# EAGLE design FT2232H-breakout-v1a (EAGLE 5.11)
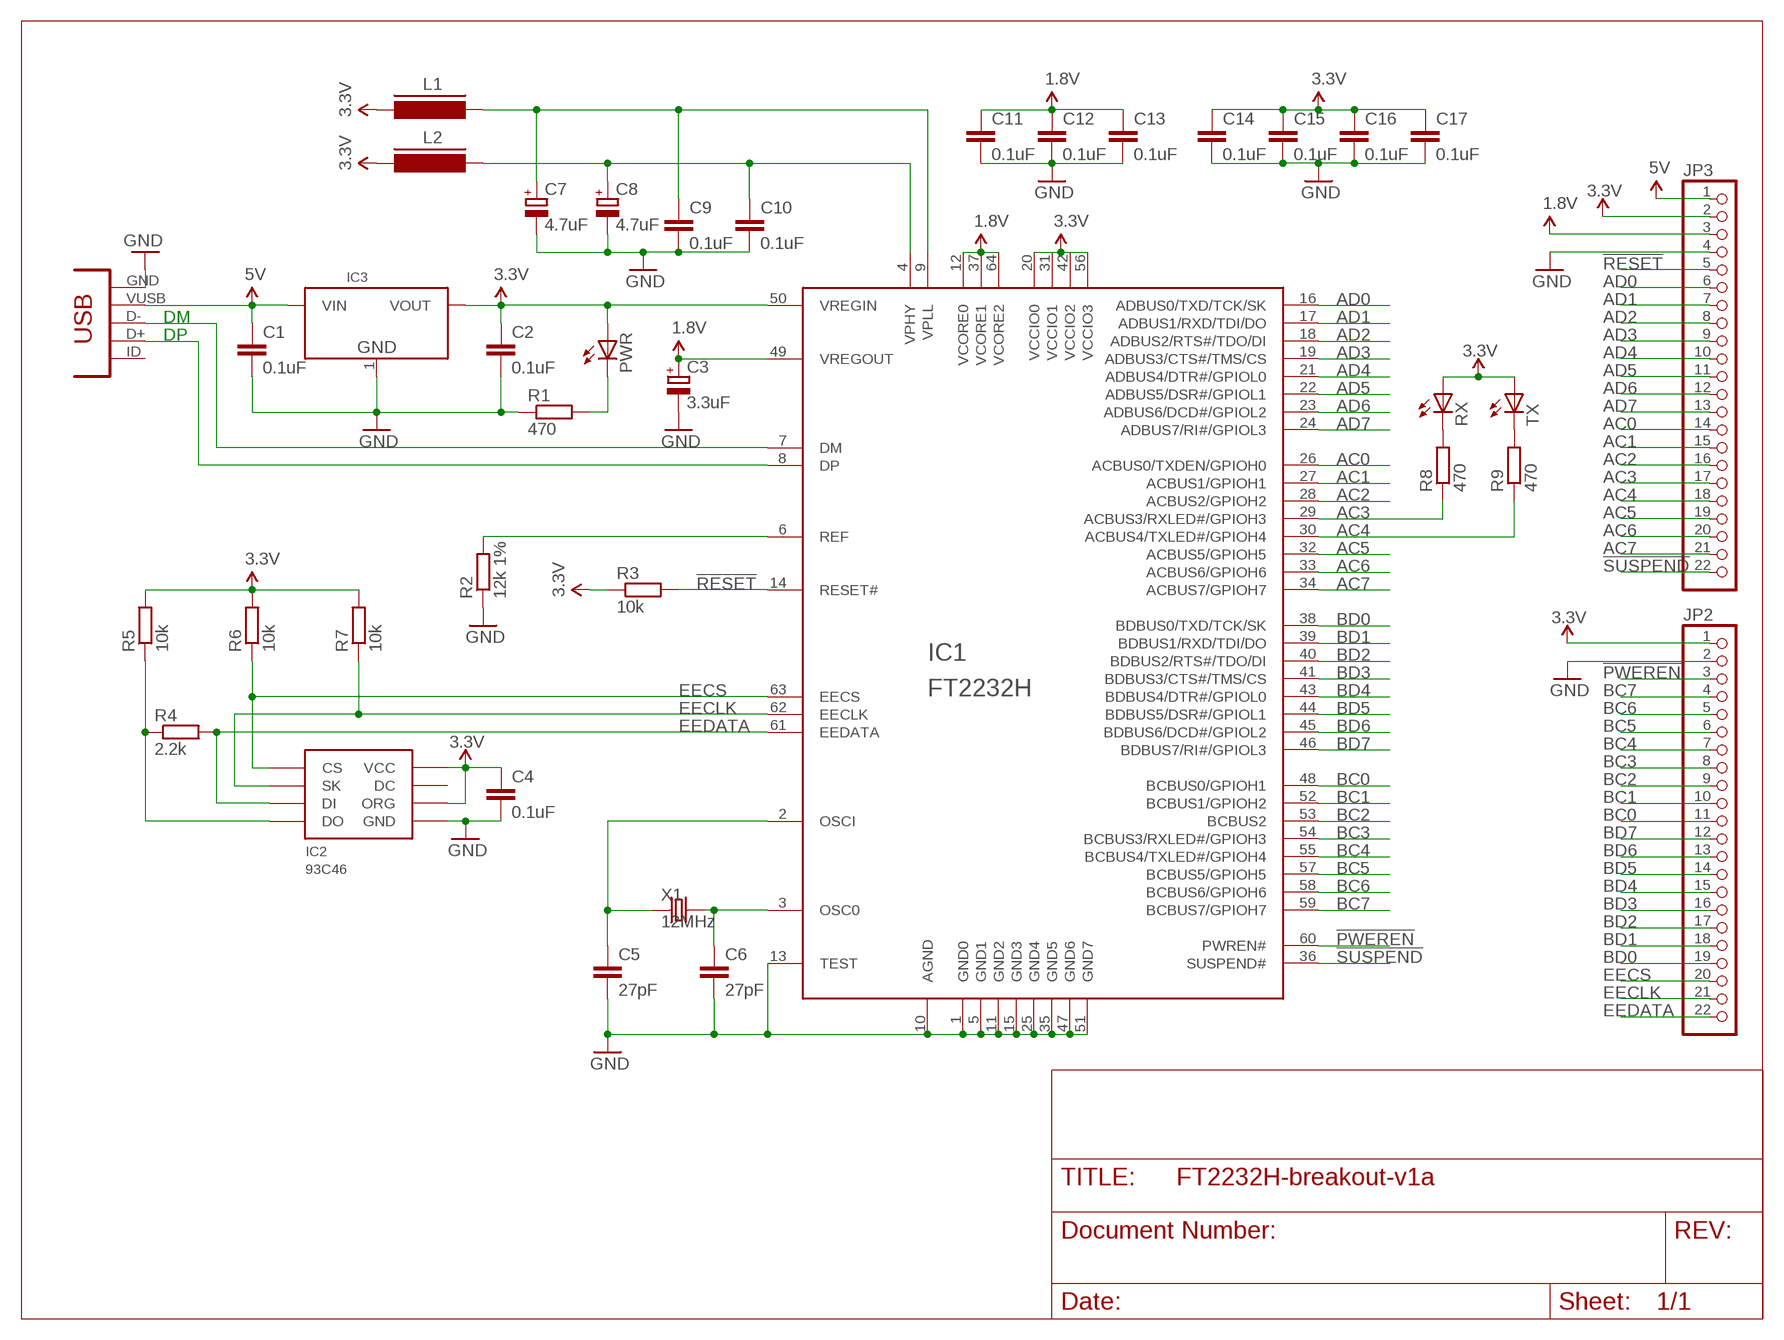
[diagram p0: schematic, sheet 1]

## Parts
C1  0.1uF  CAPC805  [C805]
C2  0.1uF  CAPC805  [C805]
C3  3.3uF  CAP_POLSMC_A  [SMC_A]
C4  0.1uF  CAPC805  [C805]
C5  27pF  CAPC805  [C805]
C6  27pF  CAPC805  [C805]
C7  4.7uF  CAP_POLSMC_A  [SMC_A]
C8  4.7uF  CAP_POLSMC_A  [SMC_A]
C9  0.1uF  CAPC805  [C805]
C10  0.1uF  CAPC805  [C805]
C11  0.1uF  CAPC805  [C805]
C12  0.1uF  CAPC805  [C805]
C13  0.1uF  CAPC805  [C805]
C14  0.1uF  CAPC805  [C805]
C15  0.1uF  CAPC805  [C805]
C16  0.1uF  CAPC805  [C805]
C17  0.1uF  CAPC805  [C805]
CONN1  CONN_USB  [CONN_USB_MINI-B]
IC1  FT2232H  [LQFP64]
IC2  93C46  [SOIC8]
IC3  LD1117-3.3SOT223  [SOT223]
JP2  PINHD-1X22  [1X22]
JP3  PINHD-1X22  [1X22]
L1  FERRITE_BEAD805  [FB805]
L2  FERRITE_BEAD805  [FB805]
PWR  LED805  [LED-805]
R1  470  RESISTORR805R805  [R805]
R2  12k 1%  RESISTORR805R805  [R805]
R3  10k  RESISTORR805R805  [R805]
R4  2.2k  RESISTORR805R805  [R805]
R5  10k  RESISTORR805R805  [R805]
R6  10k  RESISTORR805R805  [R805]
R7  10k  RESISTORR805R805  [R805]
R8  470  RESISTORR805R805  [R805]
R9  470  RESISTORR805R805  [R805]
RX  LED805  [LED-805]
TX  LED805  [LED-805]
X1  12MHz  CRYSTAL_212M_  [4X6]

## Nets
1.8V: C3.+ C11.1 C12.1 C13.1 IC1.12(VCORE0) IC1.37(VCORE1) IC1.49(VREGOUT) IC1.64(VCORE2) JP3.3
3.3V: C2.1 C4.1 C14.1 C15.1 C16.1 C17.1 IC1.20(VCCIO0) IC1.31(VCCIO1) IC1.42(VCCIO2) IC1.50(VREGIN) IC1.56(VCCIO3) IC2.6(ORG) IC2.8(VCC) IC3.2(VOUT) JP2.1 JP3.2 L1.2 L2.2 PWR.A R3.1 R5.2 R6.2 R7.2 RX.A TX.A
5V: C1.1 CONN1.VUSB IC3.3(VIN) JP3.1
!PWEREN: IC1.60(PWREN#) JP2.3
!RESET: IC1.14(RESET#) JP3.5 R3.2
!SUSPEND: IC1.36(SUSPEND#) JP3.22
AC0: IC1.26(ACBUS0/TXDEN/GPIOH0) JP3.14
AC1: IC1.27(ACBUS1/GPIOH1) JP3.15
AC2: IC1.28(ACBUS2/GPIOH2) JP3.16
AC3: IC1.29(ACBUS3/RXLED#/GPIOH3) JP3.17 R8.1
AC4: IC1.30(ACBUS4/TXLED#/GPIOH4) JP3.18 R9.1
AC5: IC1.32(ACBUS5/GPIOH5) JP3.19
AC6: IC1.33(ACBUS6/GPIOH6) JP3.20
AC7: IC1.34(ACBUS7/GPIOH7) JP3.21
AD0: IC1.16(ADBUS0/TXD/TCK/SK) JP3.6
AD1: IC1.17(ADBUS1/RXD/TDI/DO) JP3.7
AD2: IC1.18(ADBUS2/RTS#/TDO/DI) JP3.8
AD3: IC1.19(ADBUS3/CTS#/TMS/CS) JP3.9
AD4: IC1.21(ADBUS4/DTR#/GPIOL0) JP3.10
AD5: IC1.22(ADBUS5/DSR#/GPIOL1) JP3.11
AD6: IC1.23(ADBUS6/DCD#/GPIOL2) JP3.12
AD7: IC1.24(ADBUS7/RI#/GPIOL3) JP3.13
BC0: IC1.48(BCBUS0/GPIOH1) JP2.11
BC1: IC1.52(BCBUS1/GPIOH2) JP2.10
BC2: IC1.53(BCBUS2) JP2.9
BC3: IC1.54(BCBUS3/RXLED#/GPIOH3) JP2.8
BC4: IC1.55(BCBUS4/TXLED#/GPIOH4) JP2.7
BC5: IC1.57(BCBUS5/GPIOH5) JP2.6
BC6: IC1.58(BCBUS6/GPIOH6) JP2.5
BC7: IC1.59(BCBUS7/GPIOH7) JP2.4
BD0: IC1.38(BDBUS0/TXD/TCK/SK) JP2.19
BD1: IC1.39(BDBUS1/RXD/TDI/DO) JP2.18
BD2: IC1.40(BDBUS2/RTS#/TDO/DI) JP2.17
BD3: IC1.41(BDBUS3/CTS#/TMS/CS) JP2.16
BD4: IC1.43(BDBUS4/DTR#/GPIOL0) JP2.15
BD5: IC1.44(BDBUS5/DSR#/GPIOL1) JP2.14
BD6: IC1.45(BDBUS6/DCD#/GPIOL2) JP2.13
BD7: IC1.46(BDBUS7/RI#/GPIOL3) JP2.12
DM: CONN1.D- IC1.7(DM)
DP: CONN1.D+ IC1.8(DP)
EECLK: IC1.62(EECLK) IC2.2(SK) JP2.21 R7.1
EECS: IC1.63(EECS) IC2.1(CS) JP2.20 R6.1
EEDATA: IC1.61(EEDATA) IC2.3(DI) JP2.22 R4.2
GND: C1.2 C2.2 C3.- C4.2 C5.2 C6.2 C7.- C8.- C9.2 C10.2 C11.2 C12.2 C13.2 C14.2 C15.2 C16.2 C17.2 CONN1.GND IC1.1(GND0) IC1.5(GND1) IC1.10(AGND) IC1.11(GND2) IC1.13(TEST) IC1.15(GND3) IC1.25(GND4) IC1.35(GND5) IC1.47(GND6) IC1.51(GND7) IC2.5(GND) IC3.1(GND) JP2.2 JP3.4 R1.1 R2.1
N$1: PWR.C R1.2
N$2: R8.2 RX.C
N$3: R9.2 TX.C
N$4: IC1.6(REF) R2.2
N$9: C5.1 IC1.2(OSCI) X1.1(X1)
N$10: C6.1 IC1.3(OSC0) X1.2(X2)
N$45: IC2.4(DO) R4.1 R5.1
N$48: C8.+ C10.1 IC1.4(VPHY) L2.1
N$49: C7.+ C9.1 IC1.9(VPLL) L1.1
Unconnected: CONN1.BODY@1(BODY) CONN1.BODY@2(BODY) CONN1.BODY@3(BODY) CONN1.BODY@4(BODY) CONN1.ID(USBID) IC2.7(DC)

## Library data of the parts
C1 C2 C4-C6 C9-C17 = dp_devices:CAP
C3 C7 C8 = dp_devices:CAP_POL
CONN1 = dp_devices:CONN_USB: USB connector
IC1 = DP-EagleLibrary:FT2232H: DUAL HIGH SPEED USB TO MULTIPURPOSE UART/FIFO IC
IC2 = dp_devices:93C46; 93C46: 93C46
IC3 = dp_devices:LD1117-3.3
JP2 JP3 = pinhead - Copy:PINHD-1X22: PIN HEADER
L1 L2 = dp_devices:FERRITE_BEAD
PWR RX TX = dp_devices:LED
R1-R9 = dp_devices:RESISTOR
X1 = dp_devices:CRYSTAL_2

## Board
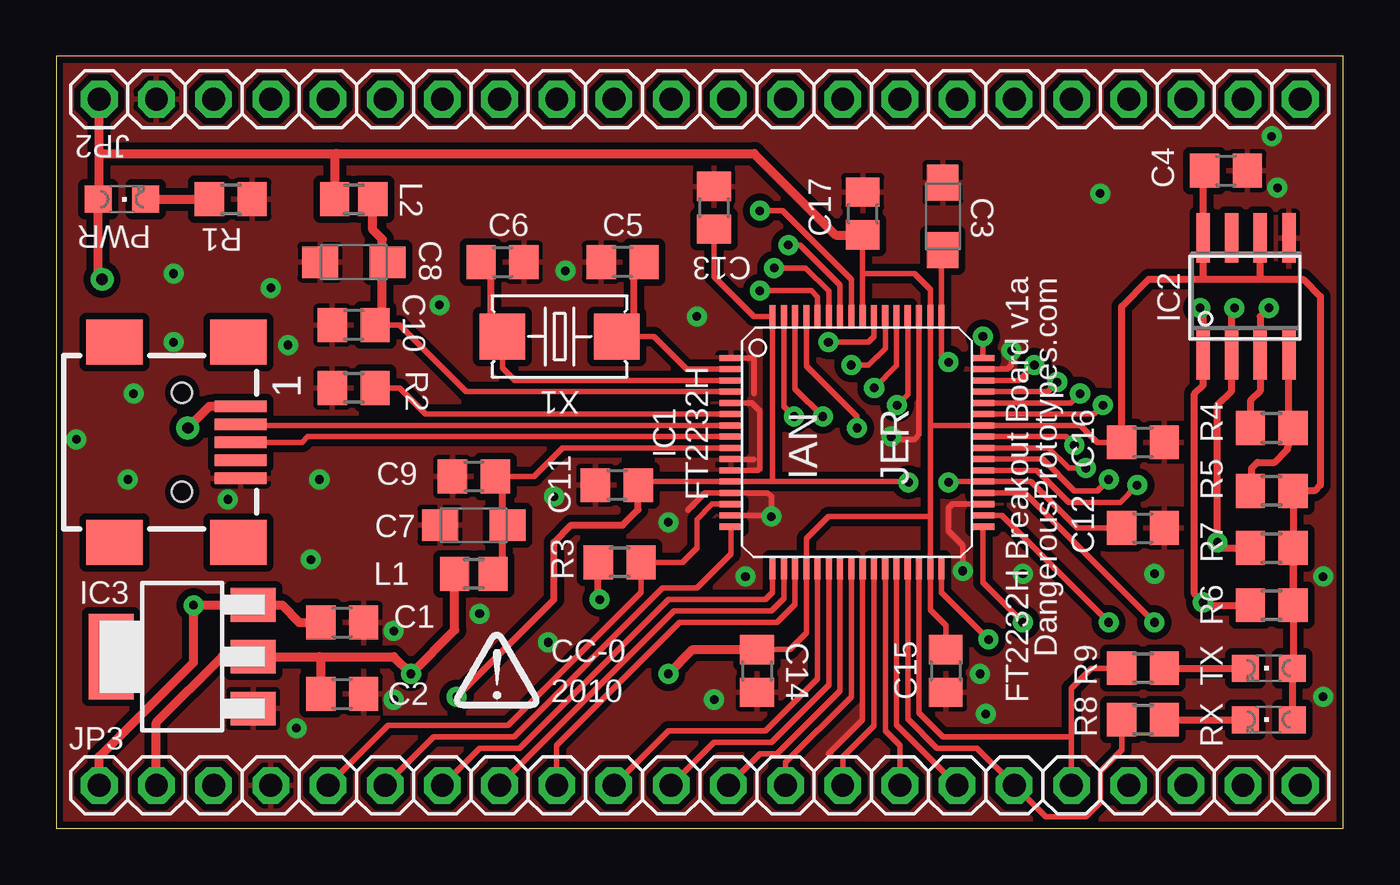
[diagram p1: board, top side]
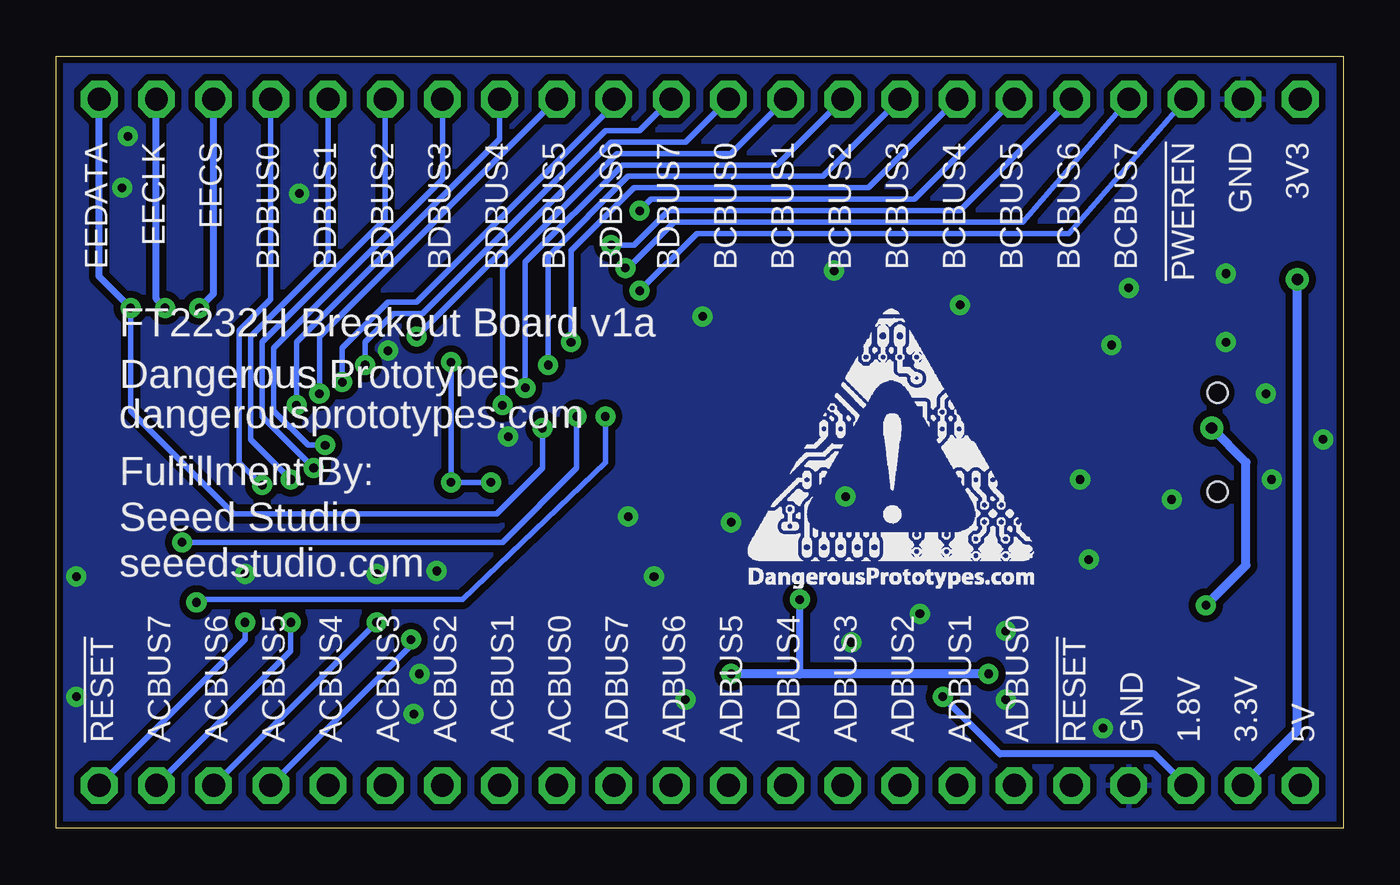
[diagram p2: board, bottom side, seen from below]

Size 57.15 x 34.29 mm. Coordinates in mm from the lower left corner, seen from the top.
Outline: 0,0 57.15,0 57.15,34.29 0,34.29 0,0
Copper layers (1*16): Top 0.035mm / dielectric 1.5mm / Bottom 0.035mm
Design rules "SparkFun *": minimum track width 8mil, minimum drill 15mil, track to track 8mil, track to pad 8mil, pad to pad 8mil, via to via 8mil, smd to smd 8mil, copper to edge 10mil, drill to drill 8mil, minimum pad ring 12mil, minimum via ring 10mil, stop-mask expansion 4mil, vias tented up to drill 25mil, thermal gap 8mil

### Footprints (pad centres in the part's own frame; a part is rotated, then mirrored left to right if it is on the bottom)
C805 = smd 1.3 x 1.5: 1 -0.95,0; 2 0.95,0
SMC_A = smd 1.6 x 1.4: + -1.5,0; - 1.5,0
CONN_USB_MINI-B = smd 2 x 2.5: BODY@1 -4.45,2.5; BODY@2 4.45,2.5; BODY@3 4.45,-3; BODY@4 -4.45,-3 | smd 0.5 x 2.3: D+ 0,2.6; D- -0.8,2.6; GND 1.6,2.6; ID 0.8,2.6; VUSB -1.6,2.6 | hole 0.9: -2.2,0; 2.2,0
LQFP64 = smd 1 x 0.27: 1 -5.6,3.75; 2 -5.6,3.25; 3 -5.6,2.75; 4 -5.6,2.25; 5 -5.6,1.75; 6 -5.6,1.25; 7 -5.6,0.75; 8 -5.6,0.25; 9 -5.6,-0.25; 10 -5.6,-0.75; 11 -5.6,-1.25; 12 -5.6,-1.75; 13 -5.6,-2.25; 14 -5.6,-2.75; 15 -5.6,-3.25; 16 -5.6,-3.75; 33 5.6,-3.75; 34 5.6,-3.25; 35 5.6,-2.75; 36 5.6,-2.25; 37 5.6,-1.75; 38 5.6,-1.25; 39 5.6,-0.75; 40 5.6,-0.25; 41 5.6,0.25; 42 5.6,0.75; 43 5.6,1.25; 44 5.6,1.75; 45 5.6,2.25; 46 5.6,2.75; 47 5.6,3.25; 48 5.6,3.75 | smd 0.27 x 1: 17 -3.75,-5.6; 18 -3.25,-5.6; 19 -2.75,-5.6; 20 -2.25,-5.6; 21 -1.75,-5.6; 22 -1.25,-5.6; 23 -0.75,-5.6; 24 -0.25,-5.6; 25 0.25,-5.6; 26 0.75,-5.6; 27 1.25,-5.6; 28 1.75,-5.6; 29 2.25,-5.6; 30 2.75,-5.6; 31 3.25,-5.6; 32 3.75,-5.6; 49 3.75,5.6; 50 3.25,5.6; 51 2.75,5.6; 52 2.25,5.6; 53 1.75,5.6; 54 1.25,5.6; 55 0.75,5.6; 56 0.25,5.6; 57 -0.25,5.6; 58 -0.75,5.6; 59 -1.25,5.6; 60 -1.75,5.6; 61 -2.25,5.6; 62 -2.75,5.6; 63 -3.25,5.6; 64 -3.75,5.6
SOIC8 = smd 0.6 x 2.2: 1 -1.905,-2.6; 2 -0.635,-2.6; 3 0.635,-2.6; 4 1.905,-2.6; 5 1.905,2.6; 6 0.635,2.6; 7 -0.635,2.6; 8 -1.905,2.6
SOT223 = smd 1.5 x 2: 1 -2.3,-3.15; 2 0,-3.15; 3 2.3,-3.15 | smd 3.8 x 2: 4 0,3.15
1X22 = drill 1.016 octagon: 1 -26.67,0; 2 -24.13,0; 3 -21.59,0; 4 -19.05,0; 5 -16.51,0; 6 -13.97,0; 7 -11.43,0; 8 -8.89,0; 9 -6.35,0; 10 -3.81,0; 11 -1.27,0; 12 1.27,0; 13 3.81,0; 14 6.35,0; 15 8.89,0; 16 11.43,0; 17 13.97,0; 18 16.51,0; 19 19.05,0; 20 21.59,0; 21 24.13,0; 22 26.67,0
FB805 = smd 1.3 x 1.5: 1 -0.85,0; 2 0.85,0
LED-805 = smd 1.2 x 1.2: A 0,-1.05; C 0,1.05
R805 = smd 1.3 x 1.5: 1 -0.95,0; 2 0.95,0
4X6 = smd 2.032 x 2.032: 1 -2.54,0; 2 2.54,0

### Placement (x,y rotation side)
C1  12.7,9.14 0 top
C2  12.7,5.97 0 top
C3  39.37,27.18 90 top
C4  51.94,29.21 0 top
C5  25.15,25.15 180 top
C6  19.81,25.15 0 top
C7  18.54,13.46 180 top
C8  13.21,25.15 180 top
C9  18.54,15.62 180 top
C10  13.21,22.35 180 top
C11  24.89,15.24 180 top
C12  48.26,13.34 0 top
C13  29.21,27.56 90 top
C14  31.11,6.99 270 top
C15  39.5,6.99 270 top
C16  48.26,17.14 0 top
C17  35.81,27.3 90 top
CONN1  5.59,17.14 270 top
IC1  35.56,17.14 0 top
IC2  52.83,23.62 0 top
IC3  5.59,7.62 90 top
JP2  28.57,32.38 0 top
JP3  28.57,1.91 0 top
L1  18.54,11.3 180 top
L2  13.21,27.94 180 top
PWR  2.92,27.94 270 top
R1  7.75,27.94 180 top
R2  13.21,19.56 0 top
R3  25.02,11.81 0 top
R4  53.98,17.78 180 top
R5  53.98,14.99 0 top
R6  53.98,9.91 0 top
R7  53.98,12.45 0 top
R8  48.26,4.83 0 top
R9  48.26,7.11 0 top
RX  53.85,4.83 90 top
TX  53.85,7.11 90 top
U$7  [DP_LOGO]  19.56,5.97 0 top
U$8  [DP_LOGO_ART_0.5X0.5]  26.42,10.67 0 bottom
X1  22.35,21.84 180 top

### Tracks (layer width: path | path; a pad name or v marks a point on that pad's centre or on a via)
1.8V  (via drill 0.38)
  Top 0.254: C13.1 29.21,24.51 30.99,22.73 31.8,22.73 | 31.75,15.39 IC1.12 26.25,15.39 C11.1 | 31.75,15.39 37.56,15.39 v37.85,15.37 | v39.62,15.37 39.65,15.39 IC1.37 43.28,15.39 45.34,13.34 C12.1 | v39.62,20.7 39.31,21.02 IC1.49 39.31,25.62 C3.+ | 31.8,22.73 31.8,15.44 31.75,15.39 | 31.8,22.73 IC1.64
  Top 0.305: C11.1 25.84,14.16 25.15,13.46 22.86,13.46 22.1,12.7 22.1,10.16 v17.78,5.84
  Bottom 0.254: v37.85,15.37 v39.62,15.37 v39.62,20.7
  Bottom 0.305: v17.78,5.84 15.24,3.3 8.38,3.3 JP3.3
3.3V  (via drill 0.38, 0.51)
  Top 0.254: C16.1 46.23,17.14 45.48,17.89 IC1.42 38.82,17.89 38.81,17.91 | 38.81,13.84 IC1.31 38.81,9.7 39.5,9.02 C15.1 | 38.81,17.91 38.81,13.84 | 38.81,17.91 IC1.50 38.81,23.93 38.1,24.64 35.81,24.64 | 38.81,13.84 34.29,13.84 33.31,12.86 IC1.20 33.31,8.67 32.57,7.93 C14.1 | 35.81,24.64 IC1.56 | 35.81,24.64 C17.1
  Top 0.305: C4.1 50.93,29.14 IC2.8 50.93,24.51 51.05,24.38 | C16.1 47.31,23.18 48.51,24.38 51.05,24.38 | R6.2 R5.2 55.88,14.99 56.13,15.24 56.13,23.62 55.37,24.38 53.59,24.38 | R6.2 R7.2 | 51.05,24.38 53.59,24.38 | IC2.6 53.47,24.51 53.59,24.38 | R6.2 54.92,7.14 TX.A RX.A | R3.1 24.07,10.22 v24.13,10.16
  Top 0.406: 11.68,7.62 IC3.2 7.37,7.62 4.45,4.7 JP3.2 | 11.68,7.62 14.99,7.62 v15.75,6.86 17.69,8.8 L1.2 | C2.1 11.75,7.55 11.68,7.62 | C17.1 34.6,26.36 30.99,29.97 12.45,29.97 | 1.91,29.97 1.91,28.23 PWR.A 1.87,24.55 v2.03,24.38 | 1.91,29.97 JP2.1 | 1.91,29.97 12.45,29.97 | L2.2 12.36,29.88 12.45,29.97 | C14.1 28.25,7.93 v27.18,6.86
  Bottom 0.305: 24.13,6.86 v24.13,10.16
  Bottom 0.406: v15.75,6.86 24.13,6.86 v27.18,6.86 | v2.03,24.38 2.03,4.32 JP3.2
5V  (via drill 0.38, 0.51)
  Top 0.305: v6.1,9.91 v6.11,9.92
  Top 0.406: C1.1 10.79,9.14 10.02,9.92 IC3.3 v6.11,9.92 | CONN1.VUSB 6.81,18.75 v5.84,17.78 | v6.1,9.91 6.1,7.37 1.91,3.17 JP3.1
  Bottom 0.406: v5.84,17.78 4.32,16.26 4.32,11.68 v6.1,9.91
!PWEREN  (via drill 0.38)
  Top 0.254: IC1.60 33.81,23.59 33.53,23.88 v31.24,23.88
  Bottom 0.254: v31.24,23.88 28.7,26.42 12.19,26.42 JP2.3
!RESET
  Top 0.254: JP3.5 14.73,4.57 20.07,4.57 25.97,10.47 R3.2 27.81,11.81 28.45,12.45 28.45,13.72 29.13,14.39 IC1.14
!SUSPEND  (via drill 0.38)
  Top 0.254: IC1.36 43.02,14.89 v48.77,9.14
  Bottom 0.254: v48.77,9.14 48.77,8.38 JP3.22
AC0
  Top 0.254: IC1.26 36.31,4.56 34.92,3.17 JP3.14
AC1
  Top 0.254: IC1.27 36.81,4.34 37.47,3.68 JP3.15
AC2
  Top 0.254: IC1.28 37.31,4.6 JP3.16
AC3
  Top 0.254: IC1.29 37.81,4.86 39.12,3.56 40.89,3.56 JP3.17 43.94,0.51 45.72,0.51 46.35,1.14 46.35,2.54 47.31,3.5 R8.1
AC4
  Top 0.254: R9.1 45.97,7.11 45.09,6.22 45.09,4.06 | 45.09,4.06 JP3.18 | 45.09,4.06 39.37,4.06 38.31,5.12 IC1.30
AC5  (via drill 0.38)
  Top 0.254: IC1.32 39.31,10.47 v41.4,8.38
  Bottom 0.254: v41.4,8.38 41.4,8.13 JP3.19
AC6  (via drill 0.38)
  Top 0.254: IC1.33 41.16,10.91 v42.93,9.14
  Bottom 0.254: JP3.20 v42.93,9.14
AC7  (via drill 0.38)
  Top 0.254: IC1.34 41.98,13.89 v46.74,9.14
  Bottom 0.254: v46.74,9.14 46.74,7.87 JP3.21
AD0
  Top 0.254: IC1.16 29.96,12.18 28.45,10.67 26.92,10.67 20.32,4.06 16.76,4.06 JP3.6
AD1
  Top 0.254: IC1.17 31.81,10.47 31.5,10.16 27.18,10.16 20.57,3.56 18.8,3.56 JP3.7
AD2
  Top 0.254: IC1.18 32.31,10.21 31.75,9.65 27.43,9.65 JP3.8
AD3
  Top 0.254: IC1.19 32.81,9.95 32,9.14 27.69,9.14 22.23,3.68 JP3.9
AD4
  Top 0.254: IC1.21 33.81,6.63 31.5,4.32 27.18,4.32 JP3.10
AD5
  Top 0.254: IC1.22 34.31,6.37 31.75,3.81 29.21,3.81 JP3.11
AD6
  Top 0.254: IC1.23 34.81,6.11 32,3.3 31.24,3.3 JP3.12
AD7
  Top 0.254: IC1.24 35.31,5.85 32.38,2.92 JP3.13
BC0  (via drill 0.38)
  Top 0.254: IC1.48 v41.16,21.83 v41.15,21.84
  Bottom 0.254: v41.15,21.84 32.51,30.48 29.21,30.48 JP2.11
BC1  (via drill 0.38)
  Top 0.254: IC1.52 37.81,19.27 v37.34,18.8
  Bottom 0.254: v37.34,18.8 37.34,24.89 32.26,29.97 27.18,29.97 JP2.10
BC2  (via drill 0.38)
  Top 0.254: IC1.53 37.31,20.55 v36.32,19.56
  Bottom 0.254: v36.32,19.56 36.32,25.15 32,29.46 25.15,29.46 JP2.9
BC3  (via drill 0.38)
  Top 0.254: IC1.54 36.81,21.32 36.07,20.57 v35.31,20.57
  Bottom 0.254: v35.31,20.57 35.31,25.4 31.75,28.96 23.11,28.96 JP2.8
BC4  (via drill 0.38)
  Top 0.254: IC1.55 36.31,21.83 36.07,21.59 v34.29,21.59
  Bottom 0.254: v34.29,21.59 34.29,25.65 31.5,28.45 21.08,28.45 JP2.7
BC5  (via drill 0.38)
  Top 0.254: IC1.57 35.31,24.38 32.26,27.43 v31.24,27.43
  Bottom 0.254: JP2.6 19.05,27.94 30.73,27.94 v31.24,27.43
BC6  (via drill 0.38)
  Top 0.254: IC1.58 34.81,24.12 33.02,25.91 v32.51,25.91
  Bottom 0.254: v32.51,25.91 31.5,25.91 29.97,27.43 17.02,27.43 JP2.5
BC7  (via drill 0.38)
  Top 0.254: IC1.59 34.31,23.86 33.27,24.89 v31.88,24.89
  Bottom 0.254: v31.88,24.89 31.75,24.89 29.72,26.92 14.22,26.92 JP2.4
BD0  (via drill 0.38)
  Top 0.254: IC1.38 43.54,15.89 44.96,14.48 47.24,14.48 v48.01,15.24
  Bottom 0.254: v48.01,15.24 49.02,16.26 49.02,22.1 47.62,23.5 JP2.19
BD1  (via drill 0.38)
  Top 0.254: IC1.39 43.8,16.39 45.21,14.99 46.23,14.99 v46.74,15.49
  Bottom 0.254: v46.74,15.49 48.51,17.27 48.51,21.84 45.09,25.27 JP2.18
BD2  (via drill 0.38)
  Top 0.254: IC1.40 44.06,16.89 44.96,16 v45.72,16
  Bottom 0.254: v45.72,16 48.01,18.29 48.01,21.59 42.55,27.05 JP2.17
BD3  (via drill 0.38)
  Top 0.254: IC1.41 44.84,17.39 v45.21,17.02
  Bottom 0.254: v45.21,17.02 45.97,17.02 47.5,18.54 47.5,21.34 40.01,28.83 JP2.16
BD4  (via drill 0.38)
  Top 0.254: IC1.43 46.08,18.39 v46.48,18.8
  Bottom 0.254: v46.48,18.8 46.48,21.59 37.47,30.61 JP2.15
BD5  (via drill 0.38)
  Top 0.254: IC1.44 45.06,18.89 v45.47,19.3
  Bottom 0.254: v45.47,19.3 45.47,21.84 JP2.14
BD6  (via drill 0.38)
  Top 0.254: IC1.45 44.03,19.39 v44.45,19.81
  Bottom 0.254: v44.45,19.81 44.45,21.34 42.42,23.37 41.15,23.37 32.51,32 32.51,32.38 JP2.13
BD7  (via drill 0.38)
  Top 0.254: IC1.46 42.76,19.89 v43.43,20.57
  Bottom 0.254: v43.43,20.57 43.43,21.59 42.16,22.86 40.89,22.86 32.77,30.99 31.24,30.99 JP2.12
DM
  Top 0.254: IC1.7 8.19,17.89 CONN1.D-
DP
  Top 0.254: IC1.8 11.17,17.39 10.92,17.14 CONN1.D+
EECLK  (via drill 0.38)
  Top 0.254: IC1.62 32.81,19.51 v34.04,18.29
  Top 0.305: v52.32,23.11 52.2,22.99 IC2.2 52.2,19.43 51.56,18.8 v51.56,12.7 51.82,12.45 R7.1
  Bottom 0.254: v34.04,18.29 34.04,16 37.34,12.7 v51.56,12.7
  Bottom 0.305: JP2.21 52.7,23.5 v52.32,23.11
EECS  (via drill 0.38)
  Top 0.254: IC1.63 32.31,18.74 v32.77,18.29
  Top 0.305: v50.8,23.11 50.93,22.99 IC2.1 50.93,19.68 50.55,19.3 50.55,10.41 v50.93,10.03 51.05,9.91 R6.1
  Bottom 0.254: v32.77,18.29 32.77,16.26 39.12,10.16 50.8,10.16 v50.93,10.03
  Bottom 0.305: JP2.20 50.16,23.75 v50.8,23.11
EEDATA  (via drill 0.38)
  Top 0.254: IC1.61 33.31,20.54 35.56,18.29 v35.56,17.78
  Top 0.305: R4.2 53.02,18.99 53.47,19.43 IC2.3 53.47,22.73 v53.85,23.11
  Bottom 0.254: v35.56,17.78 35.56,16 37.59,13.97 49.28,13.97 53.85,18.54 v53.85,23.11
  Bottom 0.305: JP2.22 55.24,24.51 v53.85,23.11
GND  (via drill 0.38)
  Top 0.254: IC1.15 31.75,13.89 v31.75,13.84 31.75,14.73 31.59,14.89 IC1.13 | IC1.11 31.14,15.89 31.24,16 31.24,18.54 30.89,18.89 IC1.5 | IC1.1 30.92,20.89 30.99,20.83 30.99,19.3 | IC1.47 42.24,20.39 42.42,20.57 v42.42,21.21 | IC1.51 38.31,17.48 38.1,17.27 37.21,17.27 v37.08,17.4 | IC1.35 39.8,14.39 39.62,14.22 39.62,13.21 40.26,12.57 v40.26,11.43 | IC1.25 35.81,4.82 34.29,3.3 | 29.97,16.38 30.99,16.38 | 30.01,14.9 28.82,14.9 28.05,14.13
  other vias: 14.99,8.76 14.99,5.71 10.67,4.45 11.68,15.49 7.62,14.61 29.21,5.71 18.8,9.53 28.45,22.73 22.61,24.77 21.84,8.26 17.02,23.24 42.93,11.3 48.77,11.3 5.21,21.59 9.53,24 22.1,14.73 27.18,13.59 10.29,21.46 3.43,19.3 3.17,15.49 0.89,17.27 11.3,11.94 5.21,24.64 56.26,11.18 56.26,5.84 41.02,6.86 41.27,5.08 30.61,11.18 46.35,28.19 53.98,30.73 54.23,28.45
  pour Bottom (isolate 0.305): 0,0 57.15,0 57.15,34.29 0,34.29
  pour Top (isolate 0.305): 0,0 57.15,0 57.15,34.29 0,34.29
N$1
  Top 0.406: PWR.C R1.2
N$2
  Top 0.305: R8.2 RX.C
N$3
  Top 0.305: R9.2 TX.C
N$4
  Top 0.254: IC1.6 16.4,18.39 15.24,19.56 R2.2
N$9
  Top 0.254: IC1.2 27.99,20.39 26.54,21.84 25.4,21.84 X1.1
  Top 0.305: C5.1 25.91,25.15 25.65,24.89 25.65,22.1 25.4,21.84
N$10
  Top 0.254: IC1.3 20.36,19.89 19.81,20.45 X1.2
  Top 0.305: C6.1 18.86,25.08 19.05,24.89 19.3,24.89 19.3,22.35 X1.2
N$45
  Top 0.305: IC2.4 54.74,17.34 R4.1 54.67,16.82 54.1,16.26 53.34,16.26 53.09,16 53.09,15.24 R5.1
N$48
  Top 0.254: IC1.4 18.2,19.39 15.24,22.35 C10.1
  Top 0.406: C10.1 14.16,22.03 14.48,22.35 14.48,24.49 | 14.48,24.79 C8.+ 14.48,24.49 | L2.1 14.06,26.58 14.48,26.16 14.48,24.79 | 14.48,24.49 14.48,24.79
N$49
  Top 0.254: IC1.9 22.48,16.89 21.21,15.62 C9.1 19.49,15.56 19.81,15.24
  Top 0.305: 19.81,15.24 19.81,13.69 C7.+ 20.04,13.44 19.81,13.21 19.81,11.72 L1.1

### Text on the board
tNames: IAN | JER | DangerousPrototypes.com | CC-0 | 2010 | FT2232H Breakout Board v1a
bNames: 3V3 | GND | !PWEREN | BCBUS7 | BCBUS6 | BCBUS5 | BCBUS4 | BCBUS3 | BCBUS2 | BCBUS1 | BCBUS0 | BDBUS7 | BDBUS6 | BDBUS5 | BDBUS4 | BDBUS3 | BDBUS2 | BDBUS1 | BDBUS0 | EECS | EECLK | EEDATA | FT2232H Breakout Board v1a | Dangerous Prototypes | dangerousprototypes.com | Fulfillment By: | Seeed Studio | seeedstudio.com | 5V | 3.3V | 1.8V | GND | !RESET | ADBUS0 | ADBUS1 | ADBUS2 | ADBUS3 | ADBUS4 | ADBUS5 | ADBUS6 | ADBUS7 | ACBUS0 | ACBUS1 | ACBUS2 | ACBUS3 | ACBUS4 | ACBUS5 | ACBUS6 | ACBUS7 | !RESET